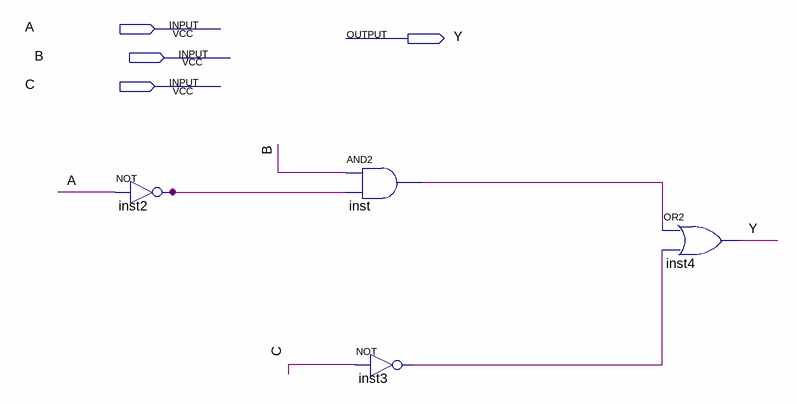
[diagram p0: schematic sheet]
// Quartus schematic Tutorial.bdf as structural Verilog: 4 symbols, 4 pins
module Tutorial (
  input  A,
  input  B,
  input  C,
  output Y
);

  wire inst2_out, inst3_out, inst_out;

  not inst2 (inst2_out, A);
  and inst (inst_out, B, inst2_out);
  not inst3 (inst3_out, C);
  or inst4 (Y, inst_out, inst3_out);
endmodule
